# Altium schematic sheet LTE_EM7455.SchDoc
size A4; DocumentNumber: 5; SheetNumber: 4; SheetTotal: 7; PostalCode_City: PostalCode_City; Country: Country; Company: Robert BOSCH GmbH; TelefonNumber: TelefonNumber; Street: Street; Department: Department
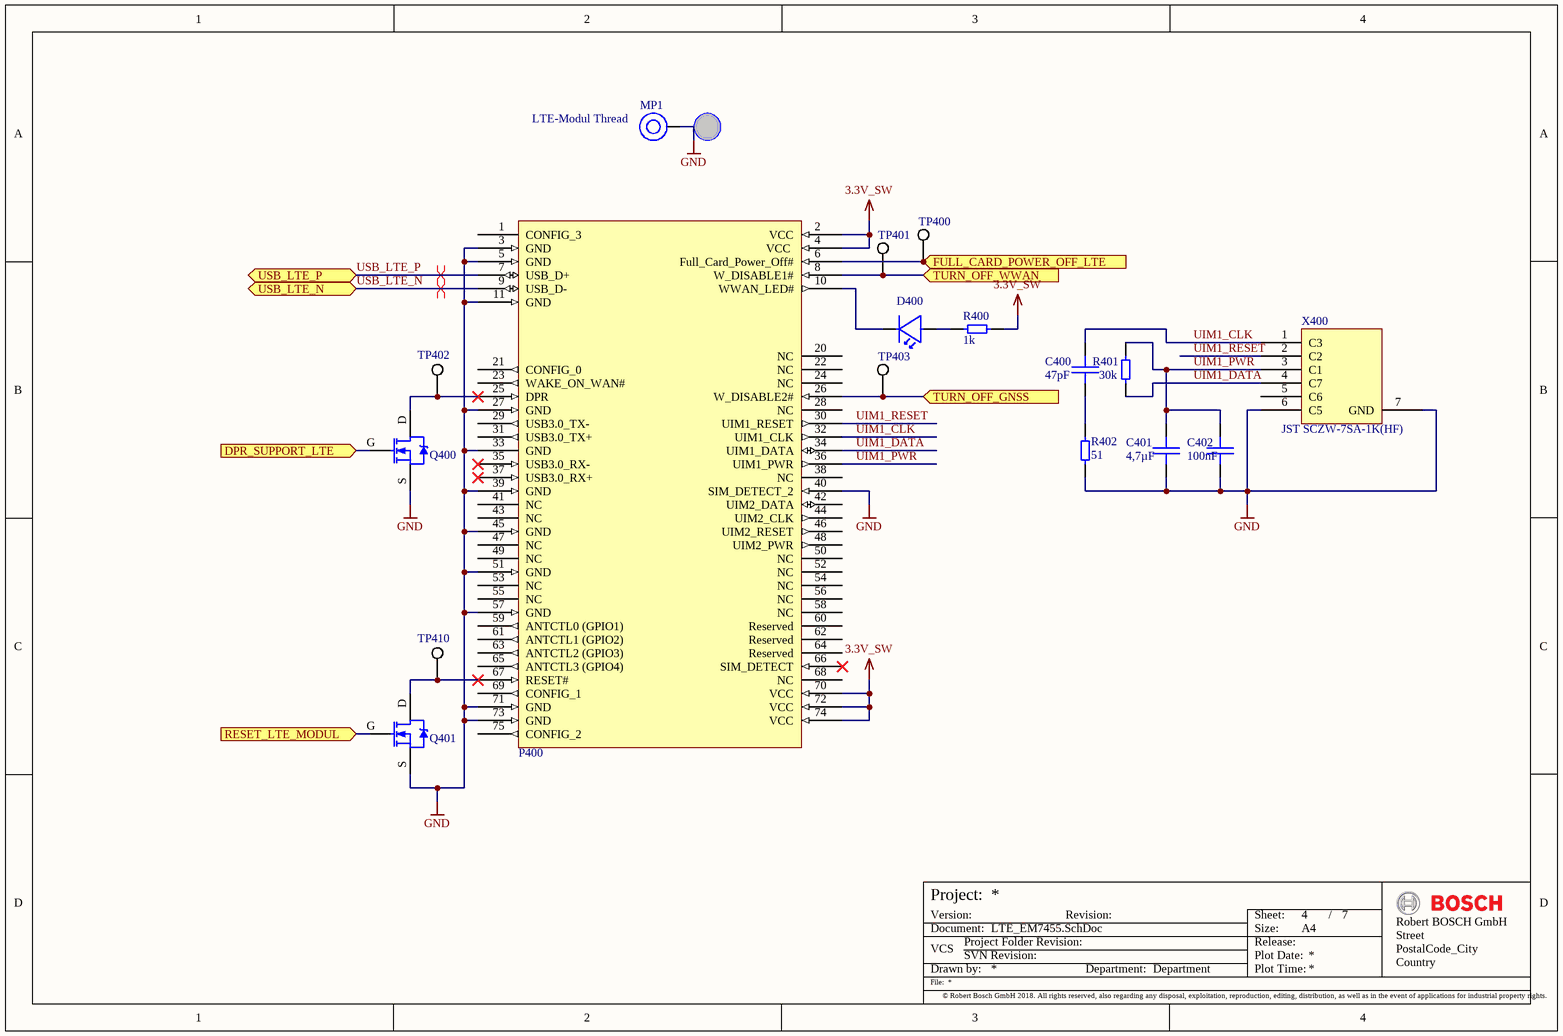
[diagram p0: LTE_EM7455.SchDoc]

## Parts
C400  Capacitance: 47pF  [CAP 0402 [1005 Metric] X050 N]  (hidden comment: CAP 0402 47p -5% +5% 25V C0G)
C401  Capacitance: 4,7µF  [CAP 0603 [1608 Metric] X080 N]  (hidden comment: CAP 0603 4u7 -20% +20% 25V X5R)
C402  Capacitance: 100nF  [CAP 0402 [1005 Metric] X050 N]  (hidden comment: CAP 0402 100n -10% +10% 35V X5R)
D400  ROHM - SML-P11MT(R)  [ROHM - SML-P11x Series]  (value not drawn)
MP1  M2.5, height 1.5mm  [9774015151]  (value not drawn)
P400  TE connectivity  M.2 (NGFF) Connectors  [M.2 (NGFF) Connectors]  (value not drawn)
Q400  ON SEMICONDUCTOR - BSS138  [SOT23127P600-8N]  (value not drawn)
Q401  ON SEMICONDUCTOR - BSS138  [SOT23127P600-8N]  (value not drawn)
R400  Resistance: 1k  [RES 0402 [1005 Metric]_N]  (hidden comment: RES 0402 1K 1% 62.5mW)
R401  Resistance: 30k  [RES 0402 [1005 Metric]_N]  (hidden comment: RES 0402 30K 1% 62.5mW)
R402  Resistance: 51  [RES 0402 [1005 Metric]_N]  (hidden comment: RES 0402 51R 1% 62.5mW)
TP400  Testpad, 1.0mm x 1.0mm, round  [Testpad, 1.0mm x 1.0mm, round]  (value not drawn)  (no BOM)
TP401  Testpad, 1.0mm x 1.0mm, round  [Testpad, 1.0mm x 1.0mm, round]  (value not drawn)  (no BOM)
TP402  Testpad, 1.0mm x 1.0mm, round  [Testpad, 1.0mm x 1.0mm, round]  (value not drawn)  (no BOM)
TP403  Testpad, 1.0mm x 1.0mm, round  [Testpad, 1.0mm x 1.0mm, round]  (value not drawn)  (no BOM)
TP410  Testpad, 1.0mm x 1.0mm, round  [Testpad, 1.0mm x 1.0mm, round]  (value not drawn)  (no BOM)
X400  JST SCZW-7SA-1K(HF)  [JST SCZW-7SA-1K(HF)]

## Ports
DPR_SUPPORT_LTE (in), FULL_CARD_POWER_OFF_LTE (in), RESET_LTE_MODUL (in), TURN_OFF_GNSS (in), TURN_OFF_WWAN (in), USB_LTE_N (bidir), USB_LTE_P (bidir)

## Nets
3.3V_SW: P400.2(VCC) P400.4(VCC) P400.70(VCC) P400.72(VCC) P400.74(VCC) R400.2
GND: C401.1 C402.1 MP1.1 P400.3(GND) P400.5(GND) P400.11(GND) P400.27(GND) P400.33(GND) P400.39(GND) P400.40(SIM_DETECT_2) P400.45(GND) P400.51(GND) P400.57(GND) P400.71(GND) P400.73(GND) Q400.S Q401.S R402.1 X400.6(C5) X400.7(GND)
DPR_SUPPORT_LTE: Q400.G ; port DPR_SUPPORT_LTE
FULL_CARD_POWER_OFF_LTE: P400.6(Full_Card_Power_Off#) TP400.1 ; port FULL_CARD_POWER_OFF_LTE
RESET_LTE_MODUL: Q401.G ; port RESET_LTE_MODUL
TURN_OFF_GNSS: P400.26(W_DISABLE2#) TP403.1 ; port TURN_OFF_GNSS
TURN_OFF_WWAN: P400.8(W_DISABLE1#) TP401.1 ; port TURN_OFF_WWAN
UIM1_CLK: C400.2 P400.32(UIM1_CLK) X400.1(C3)
UIM1_DATA: P400.34(UIM1_DATA) R401.2 X400.4(C7)
UIM1_PWR: C401.2 C402.2 P400.36(UIM1_PWR) R401.1 X400.3(C1)
UIM1_RESET: P400.30(UIM1_RESET) X400.2(C2)
USB_LTE_N: P400.9(USB_D-) ; port USB_LTE_N
USB_LTE_P: P400.7(USB_D+) ; port USB_LTE_P
NetC400_1: C400.1 R402.2
NetD400_A: D400.A R400.1
NetD400_C: D400.C P400.10(WWAN_LED#)
NetP400_25: P400.25(DPR) Q400.D TP402.1
NetP400_67: P400.67(RESET#) Q401.D TP410.1

Not connected (* = marked no-connect by the designer): P400 1(CONFIG_3) 20(NC) 21(CONFIG_0) 22(NC) 23(WAKE_ON_WAN#) 24(NC) 28(NC) 29(USB3.0_TX-) 31(USB3.0_TX+) 35(USB3.0_RX-)* 37(USB3.0_RX+)* 38(NC) 41(NC) 42(UIM2_DATA) 43(NC) 44(UIM2_CLK) 46(UIM2_RESET) 47(NC) 48(UIM2_PWR) 49(NC) 50(NC) 52(NC) 53(NC) 54(NC) 55(NC) 56(NC) 58(NC) 59(ANTCTL0_(GPIO1)) 60(Reserved) 61(ANTCTL1_(GPIO2)) 62(Reserved) 63(ANTCTL2_(GPIO3)) 64(Reserved) 65(ANTCTL3_(GPIO4)) 66(SIM_DETECT)* 68(NC) 69(CONFIG_1) 75(CONFIG_2); X400 5(C6)

## Layout directives
differential pair; differential pair class DIFF90: USB_LTE_N, USB_LTE_P

## Notes on the sheet
- (near MP1) LTE-Modul Thread
- Project:
- Version:
- Revision:
- Sheet:
- /
- Document:
- File:
- Drawn by:
- VCS
- Project Folder Revision:
- SVN Revision:
- Department:
- Plot Date:
- Size:
- Plot Time:
- Release:
- A4
- © Robert Bosch GmbH 2018. All rights reserved, also regarding any disposal, exploitation, reproduction, editing, distribution, as well as in the event of applications for industrial property rights.

## Library data of the parts
C400 = CMP-03893-2: SMD/SMT 0402 25V -5% +5% C0G - Multilayer Ceramic Capacitors MLCC; Manufacturer: MURATA; Manufacturer Part Number: GRM1555C1E470JA01#; Assembly: yes; Capacitance Tolerance pos: 5%; Value: 47pF; Capacitance Tolerance neg: -5%; Case: 0402 [1005]; ComponentLink1Description: Datasheet; ComponentLink1URL: http://psearch.en.murata.com/capacitor/lineup/grm/; Dielectric Type: C0G; IPC Footprint Naming: CAPC1005X050; Mounting Type: SMT; Operating Temperature max: 125°C; Operating Temperature min: -55°C; Voltage Rating: 25V
C401 = CMP-05102-1: SMD/SMT 0603 25V -20% +20% X5R - Multilayer Ceramic Capacitors MLCC; Manufacturer: TDK; Manufacturer Part Number: C1608X5R1E475M080AC; Assembly: yes; Capacitance Tolerance pos: 20%; Value: 4,7µF; ItemHRID: CMP-03365; RevisionId: 2; AccessRights: 15; Folder: 10 Library\Component Library\Passive Components\Capacitors\Ceramic Capacitors\; ContentType: Component; Capacitance Tolerance neg: -20%; Case: 0603 [1608]; ComponentLink1Description: Datasheet; ComponentLink1URL: http://www.farnell.com/datasheets/2291921.pdf; Dielectric Type: X5R; IPC Footprint Naming: CAPC1608X080; Mounting Type: SMT; Operating Temperature max: 85°C; Operating Temperature min: -55°C; Voltage Rating: 25V; ReleaseDate: 20/01/2017 12:59:13 PM; ComponentType: Ceramic Capacitor; FolderGUID: 1B932E09-F2A4-48AF-86E9-372599342254; LifeCycle: In Design; AncestorItemRevisionGUID: E51D455D-F8A1-44A6-8671-03D7555E002A; LifeCycleStateGUID: E3052186-9469-4B71-ADAB-0D319103D948; ContentTypeGUID: CB3C11C4-E317-11DF-B822-12313F0024A2; ItemGUID: 2606C917-888A-4062-919A-A6B1386C23AD
C402 = CMP-06091-1: SMD/SMT 0402 35V -10% +10% X5R - Multilayer Ceramic Capacitors MLCC; Manufacturer: TDK; Manufacturer Part Number: C1005X5R1V104K050BB; Assembly: yes; Value: 100nF; Capacitance Tolerance pos: 10%; Case: 0402 [1005]; ComponentLink1Description: Datasheet; ComponentLink1URL: https://de.farnell.com/tdk/c1005x5r1v104k050bb/kondensator-0-1-f-35v-10-x5r-0402/dp/2528760?st=100n%200402%2035v; Dielectric Type: X5R; IPC Footprint Naming: CAPC1005X050; Mounting Type: SMT; Operating Temperature max: 85°C; Operating Temperature min: -55°C; Voltage Rating: 35V; Capacitance Tolerance neg: -10%
D400 = CMP-06096-1: Standard LEDs - SMD Yellowish Green 569nm 2.1mcd 50mW Pd 1.9V Vf; Assembly: yes; Forward Current LED1: 20mA; Forward Voltage LED1: 1,9V; Reverse Voltage LED1: 5V; Case: 0402; Colour LED1: yellowish green; ComponentLink1Description: Datahseet; ComponentLink1URL: https://d1d2qsbl8m0m72.cloudfront.net/en/products/databook/datasheet/opto/led/chip_mono/sml-p11-e.pdf; Luminous Intensity LED1: 2.1mcd; Manufacturer: ROHM; Manufacturer Part Number: SML-P11MT(R); Mounting Type: SMT; Operating Temperature max: 85°C; Operating Temperature min: -40°C; Wavelength LED1: 569nm
MP1 = 9774015151R: SMT Steel Spacer with internal Thread M2.5 WA-SMSI, height 1.5mm; Tightening Torque: 0.35 Nm; Solder Cream Thickness: 150 um; Surface: Tin; ComponentLink1Description: Manufacturer; ComponentLink1URL: http://www.we-online.de; ComponentLink2Description: Datasheet; ComponentLink2URL: https://katalog.we-online.de/em/datasheet/9774015151R.pdf; Part Number: 9774015151R; Published Date: November 2018; Publisher: Wurth Elektronik; Operating Temperature: -55 to 150 degC; Packaging: Tape and Reel; Material: Steel; Mounting Technology: SMT; Height: 1.5 mm; Thread: M2.5
P400 = CMP-06102-3: The M.2 (Next Generation Form Factor) product line is a natural transition from the Mini Card and Half Mini Card to a smaller form factor in both size and volume.; Manufacturer Part Number: 2199119-3; Assembly: yes; Current Rating: 500mA; Gender: male; Pitch Spacing: 500µm; Voltage Rating: 50V; ComponentLink1Description: Datasheet; Manufacturer: TE connectivity; Mounting Type: SMT; Number of Pins: 67; Number of Rows: 2; Operating Temperature max: 80°C; Operating Temperature min: -40°C
Q400 Q401 = CMP-00444-5: MOSFET N-CH 50V 220MA SOT-23; Threshold Voltage: 1.3V; Transistor Polarity: N-Channel; Assembly: yes; Drain Source On Resistance: 3.5; Gate Source Voltage: 20V; Operating Temperature min: -55°C; Case: SOT23-3; ComponentLink1Description: Datasheet; ComponentLink1URL: https://www.onsemi.com/pub/Collateral/BSS138-D.PDF; Drain Current DC: 220mA; Drain Source Voltage: 50V; Manufacturer: ON SEMICONDUCTOR; Manufacturer Part Number: BSS138; Mounting Type: SMT; Operating Temperature max: 150°C
R400 = CMP-00843-3: RC0402 series chip resistor with lead-free terminations made by thick film process; Manufacturer Part Number: RC0402FR-071KL; Manufacturer: YAGEO; Power Rating: 62,5mW; Temperature Coefficient: ±100ppm/K; Voltage Rating: 50V; Assembly: yes; Current Rating: 1A; Mounting Type: SMT; Operating Temperature max: 155°C; Operating Temperature min: -55°C; Resistance Tolerance: 1%; Resistor Element Type: Thick Film; Value: 1k; Case: 0402 [1005]; ComponentLink1Description: Datasheet; ComponentLink1URL: http://www.yageo.com/documents/recent/PYu-RC0402_51_RoHS_L_6.pdf; IPC Footprint Naming: RESC1005X04
R401 = CMP-01012-3: RC0402 series chip resistor with lead-free terminations made by thick film process; Manufacturer: YAGEO; Manufacturer Part Number: RC0402FR-0730KL; Current Rating: 1A; Power Rating: 62,5mW; Temperature Coefficient: ±100ppm/K; Voltage Rating: 50V; Assembly: yes; Case: 0402 [1005]; ComponentLink1Description: Datasheet; ComponentLink1URL: http://www.yageo.com/documents/recent/PYu-RC0402_51_RoHS_L_6.pdf; IPC Footprint Naming: RESC1005X04; Mounting Type: SMT; Operating Temperature max: 155°C; Operating Temperature min: -55°C; Resistance Tolerance: 1%; Resistor Element Type: Thick Film; Value: 30k
R402 = CMP-00696-3: RC0402 series chip resistor with lead-free terminations made by thick film process; Manufacturer: YAGEO; Manufacturer Part Number: RC0402FR-0751RL; Current Rating: 1A; Temperature Coefficient: ±100ppm/K; Value: 51; Assembly: yes; Voltage Rating: 50V; Case: 0402 [1005]; ComponentLink1Description: Datasheet; ComponentLink1URL: http://www.yageo.com/documents/recent/PYu-RC0402_51_RoHS_L_6.pdf; IPC Footprint Naming: RESC1005X04; Mounting Type: SMT; Operating Temperature max: 155°C; Operating Temperature min: -55°C; Power Rating: 62.5mW; Resistance Tolerance: 1%; Resistor Element Type: Thick Film
TP400-TP403 TP410 = CMP-04511-8: Assembly: no; Case: 1.0x1.0mm, round
X400 = CMP-06150-6: SIM-Kartenleser aufklappbar und sperrfähig; Assembly: yes; Current Rating: 700mA; Memory Type: SIM; Pitch Spacing: 0mm; Case: SIM-Kartenhalter; ComponentLink1Description: Datasheet; ComponentLink1URL: http://www.farnell.com/datasheets/2280558.pdf; Manufacturer: JST; Manufacturer Part Number: SCZW-7SA-1K(HF); Mounting Type: SMT; Number of Pins: 11; Number of Rows: 5; Operating Temperature max: 85°C; Operating Temperature min: -25°C